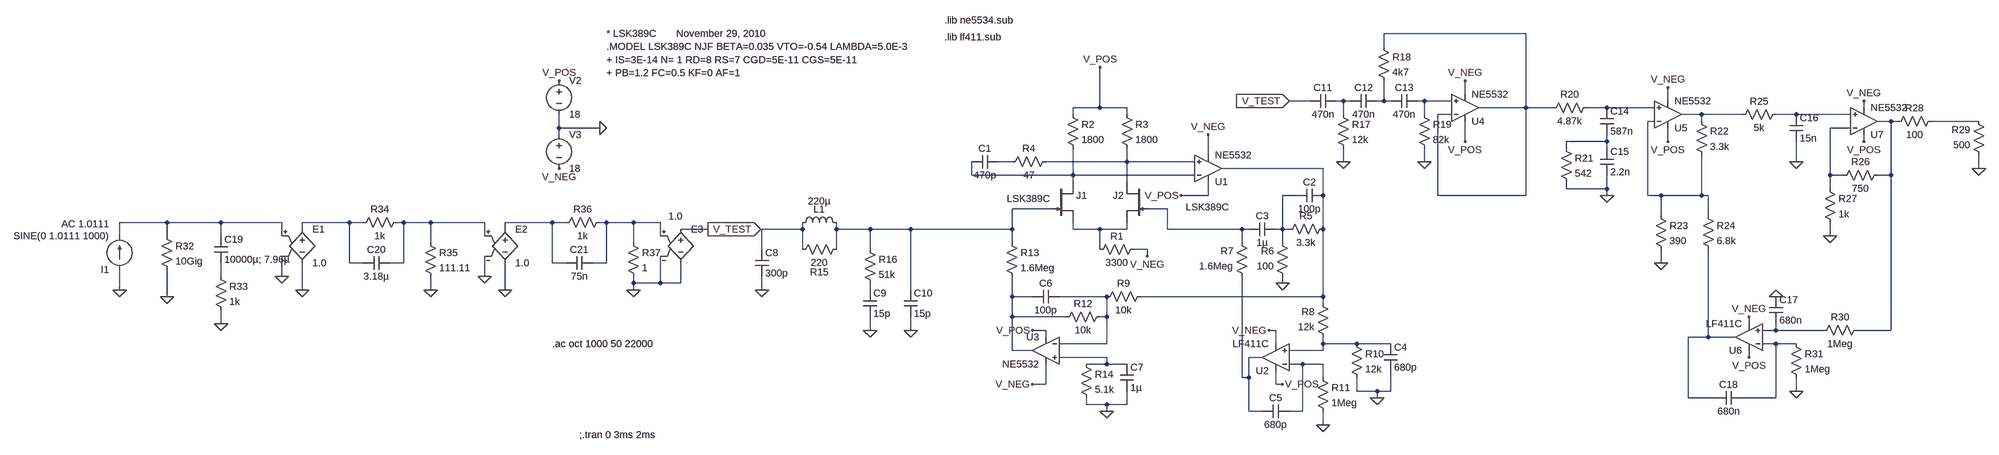
[diagram p0: schematic full_actidamp.asc]
full_actidamp.asc, the LTspice schematic file:
Version 4
SHEET 1 2276 680
WIRE 1184 -288 848 -288
WIRE 848 -256 848 -288
WIRE 1040 -144 1040 -176
WIRE 672 -128 624 -128
WIRE 752 -128 736 -128
WIRE 768 -128 752 -128
WIRE 848 -128 848 -176
WIRE 848 -128 832 -128
WIRE 864 -128 848 -128
WIRE 944 -128 928 -128
WIRE 1008 -128 944 -128
WIRE 1520 -128 1520 -160
WIRE 176 -112 176 -208
WIRE 176 -112 112 -112
WIRE 240 -112 176 -112
WIRE 1184 -112 1184 -288
WIRE 1184 -112 1072 -112
WIRE 1248 -112 1184 -112
WIRE 1376 -112 1328 -112
WIRE 1488 -112 1376 -112
WIRE 1984 -112 1984 -128
WIRE 112 -96 112 -112
WIRE 240 -96 240 -112
WIRE 752 -96 752 -128
WIRE 944 -96 944 -128
WIRE 1008 -96 976 -96
WIRE 1600 -96 1552 -96
WIRE 1696 -96 1600 -96
WIRE 1824 -96 1776 -96
WIRE 1952 -96 1824 -96
WIRE 1488 -80 1472 -80
WIRE 1600 -80 1600 -96
WIRE 2048 -80 2016 -80
WIRE 2064 -80 2048 -80
WIRE 2256 -80 2144 -80
WIRE -1104 -64 -1104 -96
WIRE -1008 -64 -1104 -64
WIRE 1952 -64 1904 -64
WIRE -1104 -48 -1104 -64
WIRE 1040 -32 1040 -80
WIRE 1376 -32 1376 -48
WIRE 1376 -32 1280 -32
WIRE 1520 -32 1520 -64
WIRE 1984 -32 1984 -48
WIRE 1280 -16 1280 -32
WIRE 1376 -16 1376 -32
WIRE 432 0 432 -48
WIRE -32 16 -64 16
WIRE 240 16 240 -16
WIRE 240 16 48 16
WIRE 400 16 240 16
WIRE 752 16 752 -16
WIRE 944 16 944 -16
WIRE 1824 16 1824 -32
WIRE 704 32 464 32
WIRE 2256 32 2256 0
WIRE -128 48 -128 16
WIRE 112 48 112 -16
WIRE 112 48 -128 48
WIRE 400 48 112 48
WIRE 1904 48 1904 -64
WIRE 1936 48 1904 48
WIRE 2048 48 2048 -80
WIRE 2048 48 2016 48
WIRE 112 64 112 48
WIRE 240 64 240 16
WIRE 1280 80 1280 64
WIRE 1376 80 1376 48
WIRE 1376 80 1280 80
WIRE 1904 80 1904 48
WIRE 432 96 432 64
WIRE 432 96 368 96
WIRE 640 96 608 96
WIRE 704 96 704 32
WIRE 976 96 976 -96
WIRE 1184 96 1184 -112
WIRE 1184 96 976 96
WIRE 1376 96 1376 80
WIRE 1472 96 1472 -80
WIRE 1504 96 1472 96
WIRE 1600 96 1600 0
WIRE 1600 96 1504 96
WIRE 1616 96 1600 96
WIRE 64 128 -32 128
WIRE 336 128 288 128
WIRE 1504 144 1504 96
WIRE 1616 144 1616 96
WIRE -2032 160 -2144 160
WIRE -1904 160 -2032 160
WIRE -1760 160 -1904 160
WIRE -1600 160 -1712 160
WIRE -1568 160 -1600 160
WIRE -1472 160 -1488 160
WIRE -1408 160 -1472 160
WIRE -1280 160 -1408 160
WIRE -1120 160 -1232 160
WIRE -1088 160 -1120 160
WIRE -992 160 -1008 160
WIRE -928 160 -992 160
WIRE -864 160 -928 160
WIRE -1712 176 -1712 160
WIRE -1232 176 -1232 160
WIRE -752 176 -816 176
WIRE -528 176 -528 160
WIRE -528 176 -624 176
WIRE -448 176 -448 160
WIRE -368 176 -448 176
WIRE -272 176 -368 176
WIRE -32 176 -32 128
WIRE -32 176 -272 176
WIRE 112 176 112 160
WIRE 176 176 112 176
WIRE 240 176 240 160
WIRE 240 176 176 176
WIRE 336 176 336 128
WIRE 512 176 336 176
WIRE 528 176 512 176
WIRE 608 176 608 96
WIRE 608 176 592 176
WIRE 624 176 608 176
WIRE 704 176 704 96
WIRE -2144 192 -2144 160
WIRE -2032 192 -2032 160
WIRE -1904 192 -1904 160
WIRE -1760 192 -1760 160
WIRE -1280 192 -1280 160
WIRE -864 192 -864 160
WIRE 1904 192 1904 160
WIRE -1408 208 -1408 160
WIRE -928 208 -928 160
WIRE -32 208 -32 176
WIRE 512 208 512 176
WIRE 608 208 608 176
WIRE -624 224 -624 176
WIRE -528 224 -528 176
WIRE -448 224 -448 176
WIRE -368 224 -368 176
WIRE 176 224 176 176
WIRE 288 224 256 224
WIRE 288 240 288 224
WIRE -1600 256 -1600 160
WIRE -1568 256 -1600 256
WIRE -1472 256 -1472 160
WIRE -1472 256 -1504 256
WIRE -1120 256 -1120 160
WIRE -1088 256 -1120 256
WIRE -992 256 -992 160
WIRE -992 256 -1024 256
WIRE 1504 256 1504 224
WIRE -1904 288 -1904 256
WIRE -1760 288 -1760 240
WIRE -1280 288 -1280 240
WIRE -928 304 -928 288
WIRE -864 304 -864 240
WIRE -864 304 -928 304
WIRE -816 304 -816 256
WIRE -816 304 -864 304
WIRE 608 304 608 288
WIRE -2144 320 -2144 272
WIRE -1712 320 -1712 256
WIRE -1408 320 -1408 288
WIRE -1232 320 -1232 256
WIRE -928 320 -928 304
WIRE -624 320 -624 288
WIRE -368 320 -368 304
WIRE -272 320 -272 176
WIRE -2032 336 -2032 272
WIRE -32 336 -32 288
WIRE 16 336 -32 336
WIRE 192 336 80 336
WIRE 704 336 704 176
WIRE 704 336 272 336
WIRE 704 352 704 336
WIRE -32 384 -32 336
WIRE 96 384 -32 384
WIRE 192 384 192 336
WIRE 192 384 176 384
WIRE -1904 400 -1904 368
WIRE 1712 400 1712 384
WIRE -368 416 -368 384
WIRE -272 416 -272 384
WIRE 48 416 16 416
WIRE 592 416 576 416
WIRE 1776 416 1776 400
WIRE 1776 416 1744 416
WIRE 1888 416 1776 416
WIRE 2048 416 2048 48
WIRE 2048 416 1968 416
WIRE 48 432 48 416
WIRE 1616 432 1616 224
WIRE 1616 432 1568 432
WIRE 1680 432 1616 432
WIRE 192 448 192 384
WIRE 192 448 80 448
WIRE 592 448 592 416
WIRE 704 448 704 432
WIRE 784 448 704 448
WIRE 864 448 784 448
WIRE 1776 448 1744 448
WIRE 1824 448 1776 448
WIRE -32 464 -32 384
WIRE 16 464 -32 464
WIRE 704 464 704 448
WIRE 704 464 624 464
WIRE 192 480 80 480
WIRE 560 480 528 480
WIRE 1712 480 1712 464
WIRE 192 496 192 480
WIRE 192 496 144 496
WIRE 240 496 192 496
WIRE 656 496 624 496
WIRE 704 496 656 496
WIRE 512 528 512 288
WIRE 528 528 528 480
WIRE 528 528 512 528
WIRE 704 528 704 496
WIRE 48 544 48 496
WIRE 48 544 16 544
WIRE 592 544 592 512
WIRE 608 544 592 544
WIRE 784 560 784 528
WIRE 832 560 784 560
WIRE 864 560 864 512
WIRE 864 560 832 560
WIRE 1824 560 1824 528
WIRE 832 576 832 560
WIRE 1568 576 1568 432
WIRE 1632 576 1568 576
WIRE 1776 576 1776 448
WIRE 1776 576 1696 576
WIRE 144 592 144 576
WIRE 192 592 144 592
WIRE 240 592 240 560
WIRE 240 592 192 592
WIRE 192 608 192 592
WIRE 528 608 528 528
WIRE 560 608 528 608
WIRE 656 608 656 496
WIRE 656 608 624 608
WIRE 704 640 704 608
FLAG 368 96 V_POS
FLAG 432 -48 V_NEG
FLAG 288 240 V_NEG
FLAG 176 -208 V_POS
FLAG 608 304 0
FLAG 832 576 0
FLAG 704 640 0
FLAG 192 608 0
FLAG 16 544 V_NEG
FLAG 16 416 V_POS
FLAG 576 416 V_NEG
FLAG 608 544 V_POS
FLAG -1008 -64 0
FLAG -1104 -176 V_POS
FLAG -1104 32 V_NEG
FLAG -624 320 0
FLAG -368 416 0
FLAG -272 416 0
FLAG 752 16 0
FLAG 944 16 0
FLAG 1040 -176 V_NEG
FLAG 1040 -32 V_POS
FLAG 1376 96 0
FLAG 1520 -32 V_POS
FLAG 1520 -160 V_NEG
FLAG 1504 256 0
FLAG 1824 16 0
FLAG 2256 32 0
FLAG 1984 -32 V_POS
FLAG 1984 -128 V_NEG
FLAG 1904 192 0
FLAG 1776 336 0
FLAG 1712 384 V_NEG
FLAG 1712 480 V_POS
FLAG 1824 560 0
FLAG -2144 320 0
FLAG -2032 336 0
FLAG -1904 400 0
FLAG -1760 288 0
FLAG -1712 320 0
FLAG -1408 320 0
FLAG -1280 288 0
FLAG -1232 320 0
FLAG -928 320 0
FLAG -752 176 V_TEST
IOPIN -752 176 Out
FLAG 624 -128 V_TEST
IOPIN 624 -128 In
SYMBOL njf 64 64 R0
WINDOW 3 -108 40 Left 2
SYMATTR Value LSK389C
SYMATTR InstName J1
SYMBOL njf 288 64 M0
WINDOW 3 -194 60 Left 2
SYMATTR Value LSK389C
SYMATTR InstName J2
SYMBOL res 272 208 R90
WINDOW 0 0 56 VBottom 2
WINDOW 3 32 56 VTop 2
SYMATTR InstName R1
SYMATTR Value 3300
SYMBOL res 96 -112 R0
SYMATTR InstName R2
SYMATTR Value 1800
SYMBOL res 224 -112 R0
SYMATTR InstName R3
SYMATTR Value 1800
SYMBOL res 64 0 R90
WINDOW 0 0 56 VBottom 2
WINDOW 3 32 56 VTop 2
SYMATTR InstName R4
SYMATTR Value 47
SYMBOL cap -64 0 R90
WINDOW 0 0 32 VBottom 2
WINDOW 3 32 32 VTop 2
SYMATTR InstName C1
SYMATTR Value 470p
SYMBOL Opamps\\opamp2 432 96 M180
SYMATTR InstName U1
SYMATTR Value NE5532
SYMBOL Opamps\\opamp2 592 544 R180
SYMATTR InstName U2
SYMATTR Value LF411C
SYMBOL Opamps\\opamp2 48 400 M0
SYMATTR InstName U3
SYMATTR Value NE5532
SYMBOL cap 704 80 R90
WINDOW 0 0 32 VBottom 2
WINDOW 3 32 32 VTop 2
SYMATTR InstName C2
SYMATTR Value 100p
SYMBOL cap 592 160 R90
WINDOW 0 0 32 VBottom 2
WINDOW 3 32 32 VTop 2
SYMATTR InstName C3
SYMATTR Value 1µ
SYMBOL res 720 160 R90
WINDOW 0 0 56 VBottom 2
WINDOW 3 32 56 VTop 2
SYMATTR InstName R5
SYMATTR Value 3.3k
SYMBOL res 624 304 R180
WINDOW 0 36 76 Left 2
WINDOW 3 36 40 Left 2
SYMATTR InstName R6
SYMATTR Value 100
SYMBOL res 528 304 R180
WINDOW 0 36 76 Left 2
WINDOW 3 36 40 Left 2
SYMATTR InstName R7
SYMATTR Value 1.6Meg
SYMBOL res 720 448 R180
WINDOW 0 36 76 Left 2
WINDOW 3 36 40 Left 2
SYMATTR InstName R8
SYMATTR Value 12k
SYMBOL res 288 320 R90
WINDOW 0 0 56 VBottom 2
WINDOW 3 32 56 VTop 2
SYMATTR InstName R9
SYMATTR Value 10k
SYMBOL res 768 432 R0
SYMATTR InstName R10
SYMATTR Value 12k
SYMBOL cap 848 448 R0
SYMATTR InstName C4
SYMATTR Value 680p
SYMBOL cap 624 592 R90
WINDOW 0 0 32 VBottom 2
WINDOW 3 32 32 VTop 2
SYMATTR InstName C5
SYMATTR Value 680p
SYMBOL res 688 512 R0
SYMATTR InstName R11
SYMATTR Value 1Meg
SYMBOL res 192 368 R90
WINDOW 0 0 56 VBottom 2
WINDOW 3 32 56 VTop 2
SYMATTR InstName R12
SYMATTR Value 10k
SYMBOL cap 80 320 R90
WINDOW 0 0 32 VBottom 2
WINDOW 3 32 32 VTop 2
SYMATTR InstName C6
SYMATTR Value 100p
SYMBOL res -48 192 R0
SYMATTR InstName R13
SYMATTR Value 1.6Meg
SYMBOL res 128 480 R0
SYMATTR InstName R14
SYMATTR Value 5.1k
SYMBOL cap 224 496 R0
SYMATTR InstName C7
SYMATTR Value 1µ
SYMBOL voltage -1104 -192 R0
WINDOW 123 0 0 Left 0
WINDOW 39 0 0 Left 0
SYMATTR InstName V2
SYMATTR Value 18
SYMBOL voltage -1104 -64 R0
WINDOW 123 0 0 Left 0
WINDOW 39 0 0 Left 0
SYMATTR InstName V3
SYMATTR Value 18
SYMBOL ind -544 176 R270
WINDOW 0 32 56 VTop 2
WINDOW 3 82 56 VBottom 2
SYMATTR InstName L1
SYMATTR Value 220µ
SYMBOL res -432 208 R90
WINDOW 0 85 56 VBottom 2
WINDOW 3 32 56 VTop 2
SYMATTR InstName R15
SYMATTR Value 220
SYMBOL cap -640 224 R0
SYMATTR InstName C8
SYMATTR Value 300p
SYMBOL res -384 208 R0
SYMATTR InstName R16
SYMATTR Value 51k
SYMBOL cap -384 320 R0
SYMATTR InstName C9
SYMATTR Value 15p
SYMBOL cap -288 320 R0
SYMATTR InstName C10
SYMATTR Value 15p
SYMBOL Opamps\\opamp2 1040 -48 M180
SYMATTR InstName U4
SYMATTR Value NE5532
SYMBOL cap 736 -144 R90
WINDOW 0 0 32 VBottom 2
WINDOW 3 32 32 VTop 2
SYMATTR InstName C11
SYMATTR Value 470n
SYMBOL cap 832 -144 R90
WINDOW 0 0 32 VBottom 2
WINDOW 3 32 32 VTop 2
SYMATTR InstName C12
SYMATTR Value 470n
SYMBOL cap 928 -144 R90
WINDOW 0 0 32 VBottom 2
WINDOW 3 32 32 VTop 2
SYMATTR InstName C13
SYMATTR Value 470n
SYMBOL res 736 -112 R0
SYMATTR InstName R17
SYMATTR Value 12k
SYMBOL res 832 -272 R0
SYMATTR InstName R18
SYMATTR Value 4k7
SYMBOL res 928 -112 R0
SYMATTR InstName R19
SYMATTR Value 82k
SYMBOL Opamps\\opamp2 1520 -32 M180
SYMATTR InstName U5
SYMATTR Value NE5532
SYMBOL res 1344 -128 R90
WINDOW 0 0 56 VBottom 2
WINDOW 3 32 56 VTop 2
SYMATTR InstName R20
SYMATTR Value 4.87k
SYMBOL cap 1360 -112 R0
SYMATTR InstName C14
SYMATTR Value 587n
SYMBOL cap 1360 -16 R0
SYMATTR InstName C15
SYMATTR Value 2.2n
SYMBOL res 1264 -32 R0
SYMATTR InstName R21
SYMATTR Value 542
SYMBOL res 1488 128 R0
SYMATTR InstName R23
SYMATTR Value 390
SYMBOL res 1600 128 R0
SYMATTR InstName R24
SYMATTR Value 6.8k
SYMBOL Opamps\\opamp2 1712 496 R180
SYMATTR InstName U6
SYMATTR Value LF411C
SYMBOL Opamps\\opamp2 1984 -16 M180
SYMATTR InstName U7
SYMATTR Value NE5532
SYMBOL res 1792 -112 R90
WINDOW 0 0 56 VBottom 2
WINDOW 3 32 56 VTop 2
SYMATTR InstName R25
SYMATTR Value 5k
SYMBOL cap 1808 -96 R0
SYMATTR InstName C16
SYMATTR Value 15n
SYMBOL res 2032 32 R90
WINDOW 0 0 56 VBottom 2
WINDOW 3 32 56 VTop 2
SYMATTR InstName R26
SYMATTR Value 750
SYMBOL res 1888 64 R0
SYMATTR InstName R27
SYMATTR Value 1k
SYMBOL res 2160 -96 R90
WINDOW 0 0 56 VBottom 2
WINDOW 3 32 56 VTop 2
SYMATTR InstName R28
SYMATTR Value 100
SYMBOL res 2272 16 R180
WINDOW 0 36 76 Left 2
WINDOW 3 36 40 Left 2
SYMATTR InstName R29
SYMATTR Value 500
SYMBOL res 1984 400 R90
WINDOW 0 0 56 VBottom 2
WINDOW 3 32 56 VTop 2
SYMATTR InstName R30
SYMATTR Value 1Meg
SYMBOL cap 1760 336 R0
SYMATTR InstName C17
SYMATTR Value 680n
SYMBOL res 1808 432 R0
SYMATTR InstName R31
SYMATTR Value 1Meg
SYMBOL cap 1696 560 R90
WINDOW 0 0 32 VBottom 2
WINDOW 3 32 32 VTop 2
SYMATTR InstName C18
SYMATTR Value 680n
SYMBOL res 1584 -96 R0
SYMATTR InstName R22
SYMATTR Value 3.3k
SYMBOL current -2144 272 R180
WINDOW 123 24 108 Left 2
WINDOW 39 0 0 Left 0
SYMATTR InstName I1
SYMATTR Value SINE(0 1.0111 1000)
SYMATTR Value2 AC 1.0111
SYMBOL res -2048 176 R0
SYMATTR InstName R32
SYMATTR Value 10Gig
SYMBOL cap -1920 192 R0
SYMATTR InstName C19
SYMATTR Value 10000µ; 7.96µ
SYMBOL res -1920 272 R0
SYMATTR InstName R33
SYMATTR Value 1k
SYMBOL e -1712 160 R0
SYMATTR InstName E1
SYMATTR Value 1.0
SYMBOL res -1472 144 R90
WINDOW 0 0 56 VBottom 2
WINDOW 3 32 56 VTop 2
SYMATTR InstName R34
SYMATTR Value 1k
SYMBOL cap -1504 240 R90
WINDOW 0 0 32 VBottom 2
WINDOW 3 32 32 VTop 2
SYMATTR InstName C20
SYMATTR Value 3.18µ
SYMBOL res -1424 192 R0
SYMATTR InstName R35
SYMATTR Value 111.11
SYMBOL e -1232 160 R0
SYMATTR InstName E2
SYMATTR Value 1.0
SYMBOL res -992 144 R90
WINDOW 0 0 56 VBottom 2
WINDOW 3 32 56 VTop 2
SYMATTR InstName R36
SYMATTR Value 1k
SYMBOL cap -1024 240 R90
WINDOW 0 0 32 VBottom 2
WINDOW 3 32 32 VTop 2
SYMATTR InstName C21
SYMATTR Value 75n
SYMBOL res -944 192 R0
SYMATTR InstName R37
SYMATTR Value 1
SYMBOL e -816 160 R0
WINDOW 3 -29 -15 Left 2
SYMATTR InstName E3
SYMATTR Value 1.0
TEXT -192 -320 Left 2 !.lib ne5534.sub
TEXT -192 -280 Left 2 !.lib lf411.sub
TEXT -992 -288 Left 2 !* LSK389C       November 29, 2010\n.MODEL LSK389C NJF BETA=0.035 VTO=-0.54 LAMBDA=5.0E-3           \n+ IS=3E-14 N= 1 RD=8 RS=7 CGD=5E-11 CGS=5E-11           \n+ PB=1.2 FC=0.5 KF=0 AF=1
TEXT -1056 664 Left 2 !;.tran 0 3ms 2ms
TEXT -1120 448 Left 2 !.ac oct 1000 50 22000

The netlist it stands for:
* full_actidamp.asc
J1 N016 N018 N026 LSK389C
J2 N014 N019 N026 LSK389C
R1 V_NEG N026 3300
R2 V_POS N016 1800
R3 V_POS N014 1800
R4 N014 N013 47
C1 N013 N016 470p
XU1 N014 N016 V_POS V_NEG N015 NE5532  ; pins In+ In- V+ V- OUT
XU2 N033 N037 V_POS V_NEG N036 LF411C  ; pins In+ In- V+ V- OUT
XU3 N035 N030 V_POS V_NEG N029 NE5532  ; pins In+ In- V+ V- OUT
C2 N015 N017 100p
C3 N017 N019 1µ
R5 N015 N017 3.3k
R6 0 N017 100
R7 N036 N019 1.6Meg
R8 N033 N015 12k
R9 N015 N030 10k
R10 N033 0 12k
C4 N033 0 680p
C5 N037 N036 680p
R11 N037 0 1Meg
R12 N030 N029 10k
C6 N030 N029 100p
R13 N018 N029 1.6Meg
R14 N035 0 5.1k
C7 N035 0 1µ
V2 V_POS 0 18
V3 0 V_NEG 18
L1 N025 N018 220µ
R15 N018 N025 220
C8 N025 0 300p
R16 N018 N028 51k
C9 N028 0 15p
C10 N018 0 15p
XU4 N004 N001 V_POS V_NEG N001 NE5532  ; pins In+ In- V+ V- OUT
C11 N002 V_TEST 470n
C12 N003 N002 470n
C13 N004 N003 470n
R17 N002 0 12k
R18 N001 N003 4k7
R19 N004 0 82k
XU5 N005 N008 V_POS V_NEG N006 NE5532  ; pins In+ In- V+ V- OUT
R20 N005 N001 4.87k
C14 N005 N012 587n
C15 N012 0 2.2n
R21 N012 0 542
R23 N008 0 390
R24 N008 N032 6.8k
XU6 N031 N034 V_POS V_NEG N032 LF411C  ; pins In+ In- V+ V- OUT
XU7 N007 N011 V_POS V_NEG N009 NE5532  ; pins In+ In- V+ V- OUT
R25 N007 N006 5k
C16 N007 0 15n
R26 N009 N011 750
R27 N011 0 1k
R28 N010 N009 100
R29 0 N010 500
R30 N009 N031 1Meg
C17 0 N031 680n
R31 N034 0 1Meg
C18 N034 N032 680n
R22 N006 N008 3.3k
I1 0 N020 SINE(0 1.0111 1000) AC 1.0111
R32 N020 0 10Gig
C19 N020 N027 10000µ; 7.96µ
R33 N027 0 1k
E1 N021 0 N020 0 1.0
R34 N022 N021 1k
C20 N022 N021 3.18µ
R35 N022 0 111.11
E2 N023 0 N022 0 1.0
R36 N024 N023 1k
C21 N024 N023 75n
R37 N024 0 1
E3 V_TEST 0 N024 0 1.0
.model NJF NJF
.model PJF PJF
.lib standard.jft
.lib ne5534.sub
.lib lf411.sub
* LSK389C       November 29, 2010
.MODEL LSK389C NJF BETA=0.035 VTO=-0.54 LAMBDA=5.0E-3
+ IS=3E-14 N= 1 RD=8 RS=7 CGD=5E-11 CGS=5E-11
+ PB=1.2 FC=0.5 KF=0 AF=1
;.tran 0 3ms 2ms
.ac oct 1000 50 22000
.backanno
.end